# Altium project RGB_LED.PrjPCB
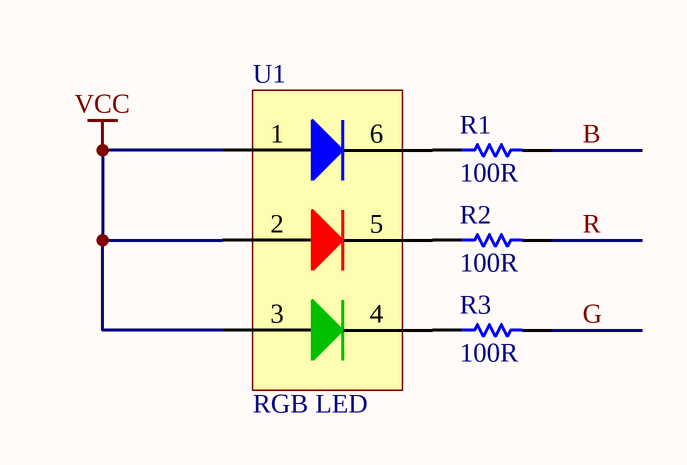
[diagram p0: Schematic.SchDoc]
1 sheet, 4 parts. Net scope: global (net labels, ports and power ports of the same name join across sheets).
Board file: PCB.PcbDoc

## Sheet Schematic.SchDoc
size A4

### Parts
R1  value 100R  [1206]  (hidden comment: Res1)
R2  value 100R  [1206]  (hidden comment: Res1)
R3  value 100R  [1206]  (hidden comment: Res1)
U1  RGB LED  [6pin_0604]

### Nets
VCC: U1.1(Banode) U1.2(Ranode) U1.3(Ranode)
B: R1.2
G: R3.2
R: R2.2
NetR1_1: R1.1 U1.6(Bcathod)
NetR2_1: R2.1 U1.5(Rcathod)
NetR3_1: R3.1 U1.4(Rcathod)

### Library data of the parts
R1-R3 = Res1: Resistor; Published: 8-Jun-2000; LatestRevisionDate: 17-Jul-2002; LatestRevisionNote: Re-released for DXP Platform.; PackageReference: AXIAL-0.3; Publisher: Altium Limited; PackageDescription: Axial Device, Thru-Hole; 2 Leads; 0.3 in Pin Spacing
U1 = SMLP36RGB2W3